# Altium schematic sheet Block_shema.SchDoc
size A4
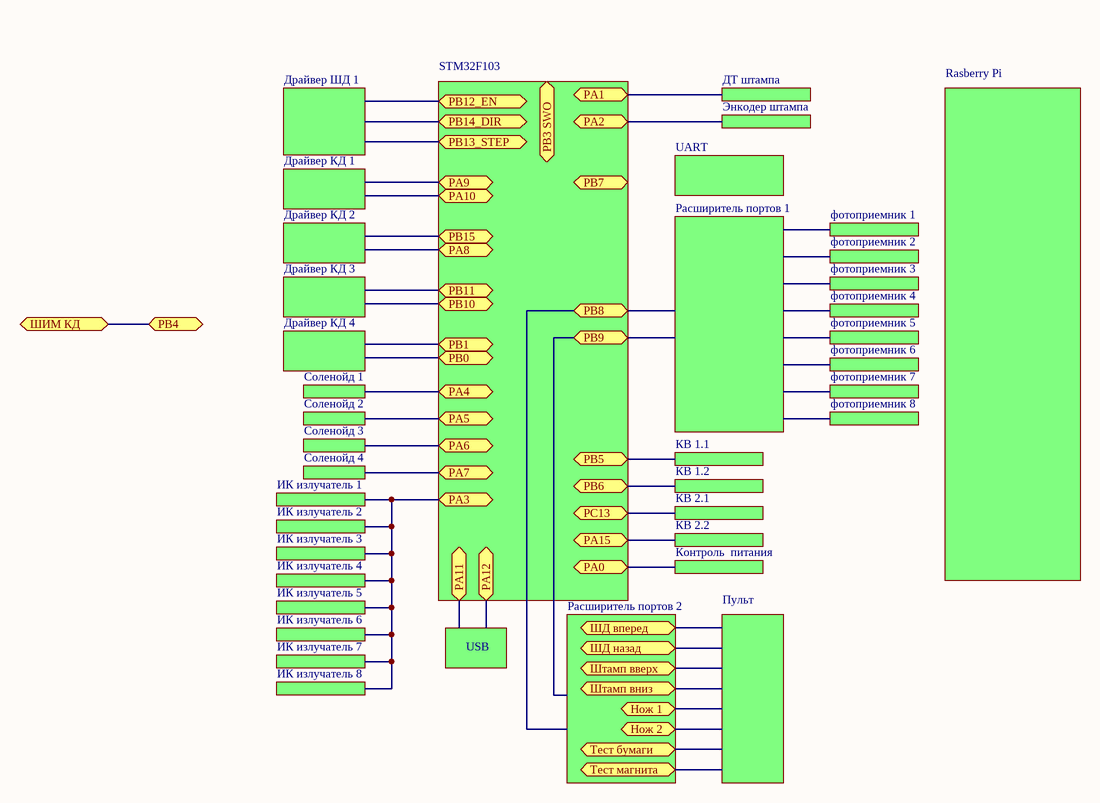
[diagram p0: Block_shema.SchDoc]

## Sub-sheets
Rasberry Pi = ?: no entries
STM32F103 = ?: no entries
UART = ?: no entries
USB = ?: no entries
Драйвер КД 1 = ?: no entries
Драйвер КД 2 = ?: no entries
Драйвер КД 3 = ?: no entries
Драйвер КД 4 = ?: no entries
Драйвер ШД 1 = ?: no entries
ДТ штампа = ?: no entries
ИК излучатель 1 = ?: no entries
ИК излучатель 2 = ?: no entries
ИК излучатель 3 = ?: no entries
ИК излучатель 4 = ?: no entries
ИК излучатель 5 = ?: no entries
ИК излучатель 6 = ?: no entries
ИК излучатель 7 = ?: no entries
ИК излучатель 8 = ?: no entries
КВ 1.1 = ?: no entries
КВ 1.2 = ?: no entries
КВ 2.1 = ?: no entries
КВ 2.2 = ?: no entries
Контроль  питания = ?: no entries
Пульт = ?: no entries
Расширитель портов 1 = ?: no entries
Расширитель портов 2 = ?: no entries
Соленойд 1 = ?: no entries
Соленойд 2 = ?: no entries
Соленойд 3 = ?: no entries
Соленойд 4 = ?: no entries
фотоприемник 1 = ?: no entries
фотоприемник 2 = ?: no entries
фотоприемник 3 = ?: no entries
фотоприемник 4 = ?: no entries
фотоприемник 5 = ?: no entries
фотоприемник 6 = ?: no entries
фотоприемник 7 = ?: no entries
фотоприемник 8 = ?: no entries
Энкодер штампа = ?: no entries

## Ports
PA0, PA1, PA2, PA3, PA4, PA5, PA6, PA7, PA8, PA9, PA10, PA11, PA12, PA15, PB0, PB1, PB3 SWO, PB4, PB5, PB6, PB7, PB8, PB9, PB10, PB11, PB12_EN, PB13_STEP, PB14_DIR, PB15, PC13, Нож 1, Нож 2, Тест бумаги, Тест магнита, ШД вперед, ШД назад, ШИМ КД, Штамп вверх, Штамп вниз

## Nets
PB4: port PB4, port ШИМ КД